# Altium schematic sheet template.SchDoc
size A4; DrawnBy: Philip Rowse

## Notes on the sheet
- This licence Applies to this doccument ONLY, other components that make up the full system come with their own licences, please check with the Author for further information
- To the extent possible under law, Philip Rowse and 3DRobotics has waived all copyright and related or neighboring
- rights to Carrier board for APM 3.0 series. This work is published from: United States, and Australia
- Title:
- Date:
- Time:
- For information on this Licence: http://creativecommons.org/publicdomain/zero/1.0/
- Sheet:
- Approved:
- of:
- Drawn By:
- Checked By:
- 3DRobotics